# Altium schematic sheet I2C-Interface.SchDoc
size A4
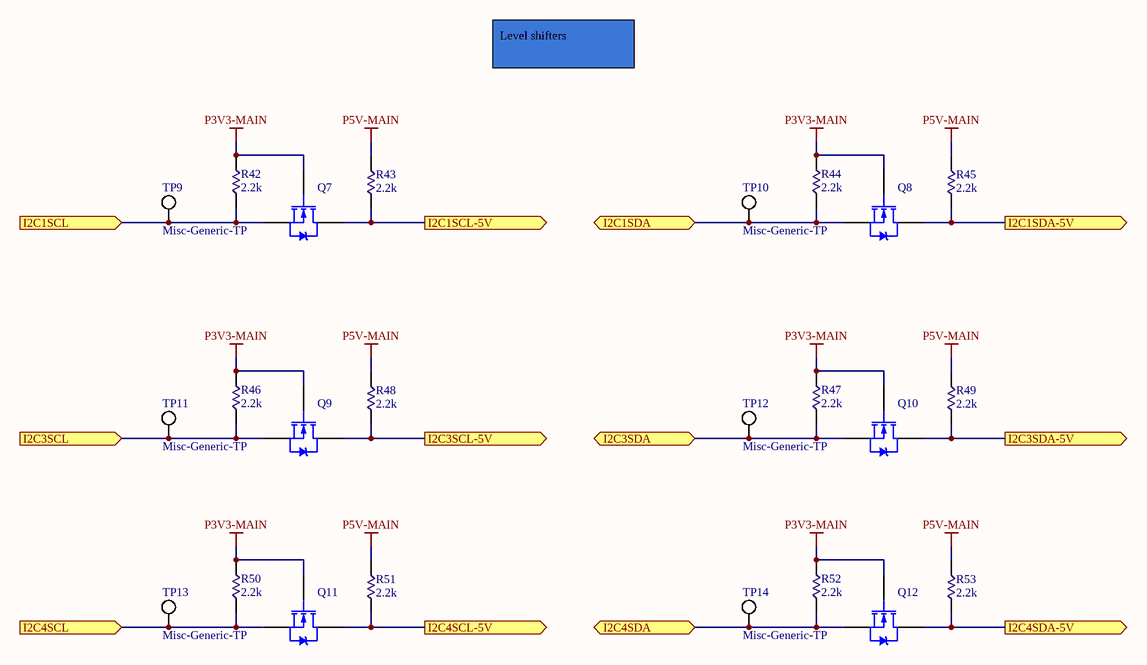
[diagram p0: I2C-Interface.SchDoc]

## Parts
Q7  BSS138Q-7-F  [FOOTPRINT-DINC-SOT23-1G2S3D]  (value not drawn)
Q8  BSS138Q-7-F  [FOOTPRINT-DINC-SOT23-1G2S3D]  (value not drawn)
Q9  BSS138Q-7-F  [FOOTPRINT-DINC-SOT23-1G2S3D]  (value not drawn)
Q10  BSS138Q-7-F  [FOOTPRINT-DINC-SOT23-1G2S3D]  (value not drawn)
Q11  BSS138Q-7-F  [FOOTPRINT-DINC-SOT23-1G2S3D]  (value not drawn)
Q12  BSS138Q-7-F  [FOOTPRINT-DINC-SOT23-1G2S3D]  (value not drawn)
R42  value 2.2k  [FOOTPRINT-0805-GEN]  (hidden comment: SMC)
R43  value 2.2k  [FOOTPRINT-0805-GEN]  (hidden comment: SMC)
R44  value 2.2k  [FOOTPRINT-0805-GEN]  (hidden comment: SMC)
R45  value 2.2k  [FOOTPRINT-0805-GEN]  (hidden comment: SMC)
R46  value 2.2k  [FOOTPRINT-0805-GEN]  (hidden comment: SMC)
R47  value 2.2k  [FOOTPRINT-0805-GEN]  (hidden comment: SMC)
R48  value 2.2k  [FOOTPRINT-0805-GEN]  (hidden comment: SMC)
R49  value 2.2k  [FOOTPRINT-0805-GEN]  (hidden comment: SMC)
R50  value 2.2k  [FOOTPRINT-0805-GEN]  (hidden comment: SMC)
R51  value 2.2k  [FOOTPRINT-0805-GEN]  (hidden comment: SMC)
R52  value 2.2k  [FOOTPRINT-0805-GEN]  (hidden comment: SMC)
R53  value 2.2k  [FOOTPRINT-0805-GEN]  (hidden comment: SMC)
TP9  Misc-Generic-TP  [FOOTPRINT-GENERIC-TP-VIA-1MM]
TP10  Misc-Generic-TP  [FOOTPRINT-GENERIC-TP-VIA-1MM]
TP11  Misc-Generic-TP  [FOOTPRINT-GENERIC-TP-VIA-1MM]
TP12  Misc-Generic-TP  [FOOTPRINT-GENERIC-TP-VIA-1MM]
TP13  Misc-Generic-TP  [FOOTPRINT-GENERIC-TP-VIA-1MM]
TP14  Misc-Generic-TP  [FOOTPRINT-GENERIC-TP-VIA-1MM]

## Ports
I2C1SCL (in), I2C1SCL-5V (out), I2C1SDA (bidir), I2C1SDA-5V (out), I2C3SCL (in), I2C3SCL-5V (out), I2C3SDA (bidir), I2C3SDA-5V (out), I2C4SCL (in), I2C4SCL-5V (out), I2C4SDA (bidir), I2C4SDA-5V (out)

## Nets
P3V3-MAIN: Q7.1(G) Q8.1(G) Q9.1(G) Q10.1(G) Q11.1(G) Q12.1(G) R42.2 R44.2 R46.2 R47.2 R50.2 R52.2
P5V-MAIN: R43.1 R45.1 R48.1 R49.1 R51.1 R53.1
I2C1SCL: Q7.2(S) R42.1 TP9.1(TP) ; port I2C1SCL
I2C1SCL-5V: Q7.3(D) R43.2 ; port I2C1SCL-5V
I2C1SDA: Q8.2(S) R44.1 TP10.1(TP) ; port I2C1SDA
I2C1SDA-5V: Q8.3(D) R45.2 ; port I2C1SDA-5V
I2C3SCL: Q9.2(S) R46.1 TP11.1(TP) ; port I2C3SCL
I2C3SCL-5V: Q9.3(D) R48.2 ; port I2C3SCL-5V
I2C3SDA: Q10.2(S) R47.1 TP12.1(TP) ; port I2C3SDA
I2C3SDA-5V: Q10.3(D) R49.2 ; port I2C3SDA-5V
I2C4SCL: Q11.2(S) R50.1 TP13.1(TP) ; port I2C4SCL
I2C4SCL-5V: Q11.3(D) R51.2 ; port I2C4SCL-5V
I2C4SDA: Q12.2(S) R52.1 TP14.1(TP) ; port I2C4SDA
I2C4SDA-5V: Q12.3(D) R53.2 ; port I2C4SDA-5V

## Notes on the sheet
- Level shifters
- Title
- Size:
- Date:
- Engineer
- A4
- Number:
- Sheet
- of
- Approved
- Revision:
- UC Riverside
- www.highlanderracing.org <https://www.highlanderracing.org>
- File:

## Library data of the parts
Q7-Q12 = Transistor-DiodesInc-BSS138-1G2S3D: N-Channel Logic Level Enhancement Mode Field Effect Transistor; Note: Pin 2 is electrically connected to pin 4.; Published: 8-Jun-2000; LatestRevisionDate: 17-Jul-2002; LatestRevisionNote: Re-released for DXP Platform.; DatasheetVersion: PD-9.814; PackageVersion: Feb-1997; PackageReference: TO-220AB; Publisher: Altium Limited; PackageDescription: TO, Thru-Hole, Vertical, Heatsink Mounted; 3 In-Line Leads; Pitch 2.54 mm; ComponentLink1Description: Manufacturer Link; ComponentLink1URL: http://www.irf.com/
R42-R53 = Resistor-Generic-0805-2012: 1/8 Watt Surface Mount Resistor